# EasyEDA Pro project ProPrj_stm32智能手表_2026-07-06.epro

# Schematic Schematic1

## Sheets
1 P1: Assembly Variant: Basic; Board Name: Board1; Create Date: 2026-06-28; Page Name: P1; Project Name: stm32智能手表; Schematic Name: Schematic1; Update Date: 2026-06-28; Company: 嘉立创EDA; Page Size: A4; Version: V1.0
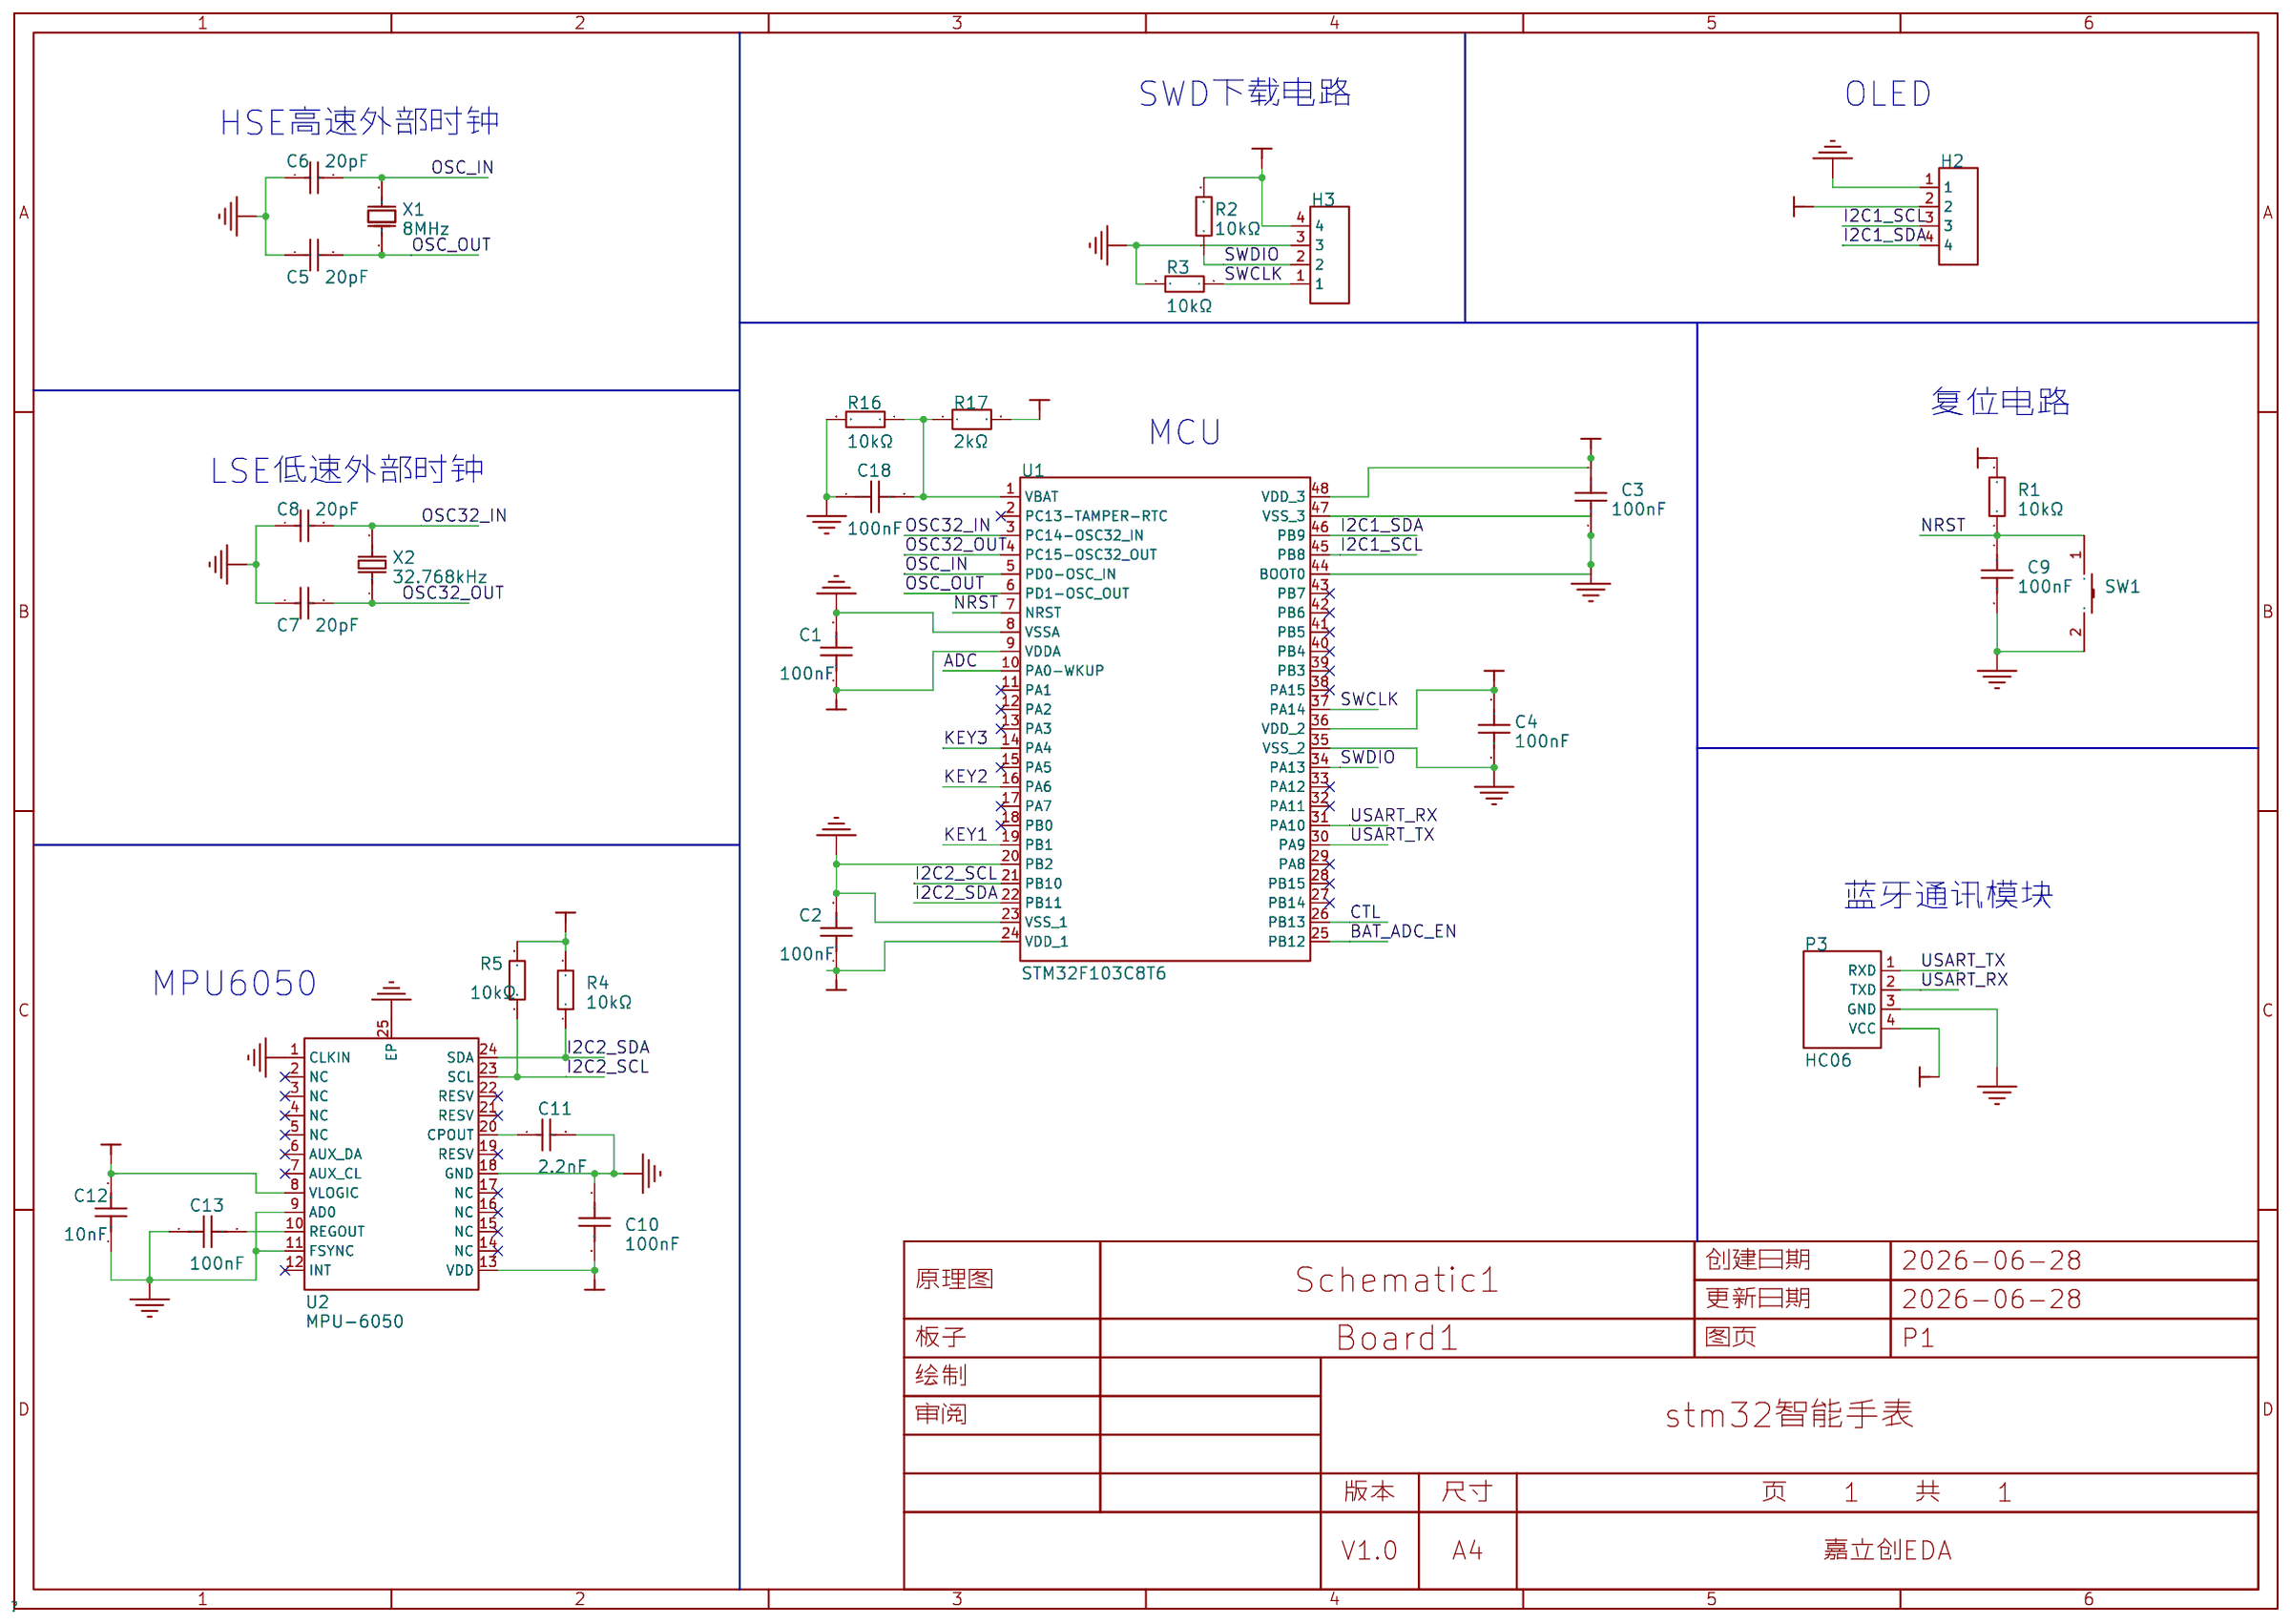
[diagram p0: P1]
2 P1_1: Schematic Name: Schematic2
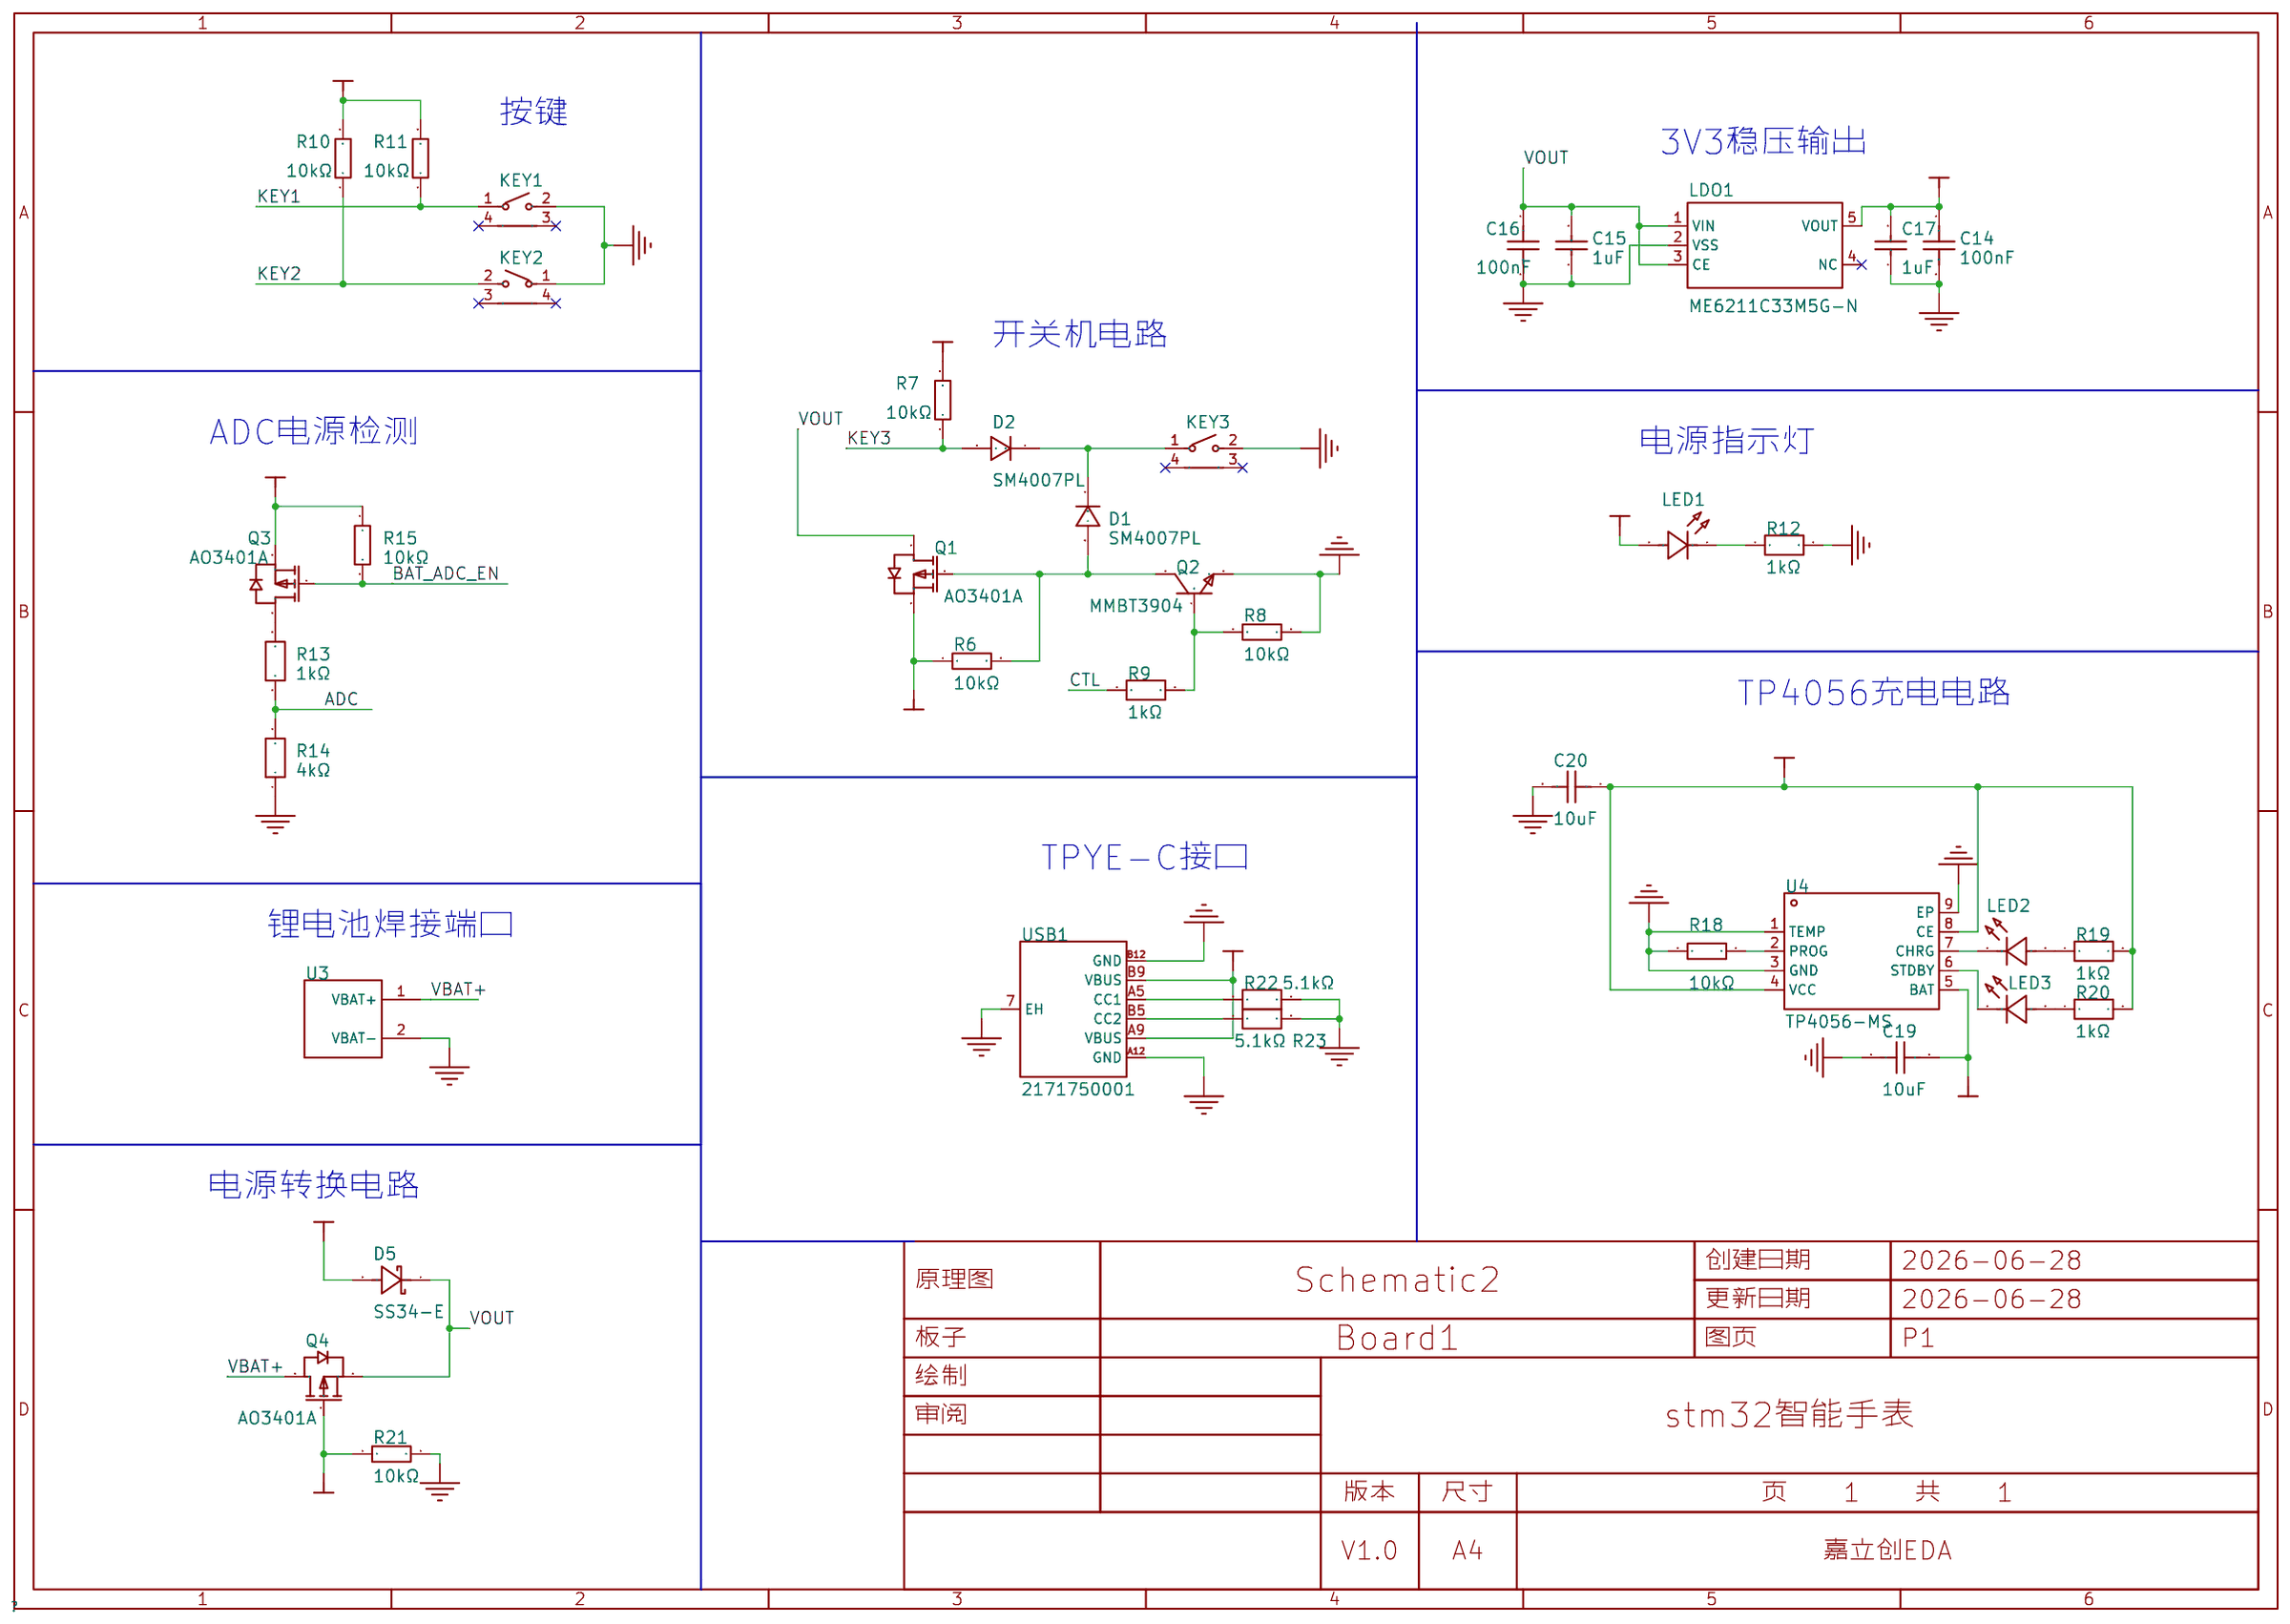
[diagram p1: P1_1]

## Parts
sheet P1
C1  100nF  [C0603]
C2  100nF  [C0603]
C3  100nF  [C0603]
C4  100nF  [C0603]
C5  20pF  [C0603]
C6  20pF  [C0603]
C7  20pF  [C0603]
C8  20pF  [C0603]
C9  100nF  [C0603]
C10  100nF  [C0603]
C11  2.2nF  [C0603]
C12  10nF  [C0603]
C13  100nF  [C0603]
C18  100nF  [C0603]
H2  HC-PM254-5.0H-1x4PZ-02A  [HDR-TH_4P-P2.54-V-F]
H3  PZ2.54R-1X4P-H25  [HDR-TH_4P-P2.54-H-M-W10.0]
P3  HC06  [HC06]
R1  10kΩ  [R0603]
R2  10kΩ  [R0603]
R3  10kΩ  [R0603]
R4  10kΩ  [R0603]
R5  10kΩ  [R0603]
R16  10kΩ  [R0603]
R17  2kΩ  [R0603]
SW1  TS-1101-C-W  [SW-SMD_L6.0-W3.3-LS8.0_TS-1101-C-W]
U1  STM32F103C8T6  [LQFP-48_L7.0-W7.0-P0.50-LS9.0-BL]
U2  MPU-6050  [QFN-24_L4.0-W4.0-P0.50-BL-EP2.7]
X1  8MHz  [CRYSTAL-SMD_L5.0-W3.2]
X2  32.768kHz  [FC-135R_L3.2-W1.5]
sheet P1_1
C14  100nF  [C0603]
C15  1uF  [C0603]
C16  100nF  [C0603]
C17  1uF  [C0603]
C19  10uF  [C0603]
C20  10uF  [C0603]
D1  SM4007PL  [SOD-123F_L2.8-W1.8-LS3.7-RD]
D2  SM4007PL  [SOD-123F_L2.8-W1.8-LS3.7-RD]
D5  SS34-E  [SMA_L4.2-W2.6-LS5.0-RD]
KEY1  GT-TC018A-H0375-L1  [SW-SMD_L4.7-W3.5-P3.35-EH]
KEY2  GT-TC018A-H0375-L1  [SW-SMD_L4.7-W3.5-P3.35-EH]
KEY3  GT-TC018A-H0375-L1  [SW-SMD_L4.7-W3.5-P3.35-EH]
LDO1  ME6211C33M5G-N  [SOT-23-5_L3.0-W1.7-P0.95-LS2.8-BL]
LED1  XL-1608SURC-06  [LED0603-RD_RED]
LED2  XL-1608SURC-06  [LED0603-RD_RED]
LED3  F.0603.00025/P2-0603G1TS2-06T-002  [LED0603-RD_GREEN]
Q1  AO3401A  [SOT-23_L2.9-W1.3-P1.90-LS2.4-BR]
Q2  MMBT3904  [SOT-23-3_L2.9-W1.3-P1.90-LS2.4-BR]
Q3  AO3401A  [SOT-23_L2.9-W1.3-P1.90-LS2.4-BR]
Q4  AO3401A  [SOT-23_L2.9-W1.3-P1.90-LS2.4-BR]
R6  10kΩ  [R0603]
R7  10kΩ  [R0603]
R8  10kΩ  [R0603]
R9  1kΩ  [R0603]
R10  10kΩ  [R0603]
R11  10kΩ  [R0603]
R12  1kΩ  [R0603]
R13  1kΩ  [R0603]
R14  4kΩ  [R0603]
R15  10kΩ  [R0603]
R18  10kΩ  [R0603]
R19  1kΩ  [R0603]
R20  1kΩ  [R0603]
R21  10kΩ  [R0603]
R22  5.1kΩ  [R0603]
R23  5.1kΩ  [R0603]
U3  -  [302530BAT]
U4  TP4056-MS  [SOP-8_L4.9-W3.9-P1.27-LS6.0-TL-EP]
USB1  2171750001  [TYPE-C-SMD_TYPE-C-6P_USB4125-GF-A-0190]

## Library data of the parts
C1-C4 C9 C10 C13 C14 C16 C18 = CC0603KRX7R9BB104: 容值:100nF;精度:±10%;额定电压:50V;温度系数:X7R;; LCSC Part Name: 100nF ±10% 50V; Supplier Part: C14663; Manufacturer: YAGEO(国巨); Supplier Footprint: 0603; JLCPCB Part Class: Basic Part; Datasheet: https://item.szlcsc.com/datasheet/CC0603KRX7R9BB104/15331.html; Supplier: LCSC; Tolerance: ±10%; Voltage Rating: 50V; Temperature Coefficient: X7R
C5-C8 = CL10C200JB8NNNC: 容值:20pF;精度:±5%;额定电压:50V;温度系数:C0G;; LCSC Part Name: 20pF ±5% 50V; Supplier Part: C1648; Manufacturer: SAMSUNG(三星); Supplier Footprint: 0603; JLCPCB Part Class: Basic Part; Datasheet: https://item.szlcsc.com/datasheet/CL10C200JB8NNNC/2000.html; Supplier: LCSC; Tolerance: ±5%; Voltage Rating: 50V; Temperature Coefficient: C0G
C11 = 0603B222K500NT: 容值:2.2nF;精度:±10%;额定电压:50V;温度系数:X7R;; LCSC Part Name: 2.2nF ±10% 50V; Supplier Part: C1604; Manufacturer: FH(风华); Supplier Footprint: 0603; JLCPCB Part Class: Basic Part; Datasheet: https://item.szlcsc.com/datasheet/0603B222K500NT/1956.html; Supplier: LCSC; Tolerance: ±10%; Voltage Rating: 50V; Temperature Coefficient: X7R
C12 = GRM1885C1H103JA01D: 容值:10nF;精度:±5%;额定电压:50V;材质(温度系数):C0G;; LCSC Part Name: 10nF ±5% 50V; Supplier Part: C85973; Manufacturer: muRata(村田); Supplier Footprint: 0603; JLCPCB Part Class: Extended Part; Datasheet: https://atta.szlcsc.com/upload/public/pdf/source/20200305/C490387_23319AE8C154DEB24C505E6C82A8106A.pdf; Supplier: LCSC; Tolerance: ±5%; Voltage Rated: 50V; Temperature Coefficient: C0G
H2 = HC-PM254-5.0H-1x4PZ-02A: 插孔结构:1x4P;间距:2.54mm;行距:-;圆孔/方孔:方孔;安装方式:直插;排数:单排;总孔位数:4P;额定电流:3A;额定电压:-;插孔方向:顶部;塑高:5mm;触头材质:黄铜;触头镀层:金;工作温度:-40℃~+105℃;; LCSC Part Name: 间距2.54mm 1x4Pin 直插 PC3.0 H5.0; Supplier Part: C42163122; Manufacturer: HC(虹成电子); Supplier Footprint: 插件,P=2.54mm; JLCPCB Part Class: Extended Part; Datasheet: https://item.szlcsc.com/datasheet/HC-PM254-5.0H-1x4PZ-02A/44033111.html; Supplier: LCSC; Holes Structure: 1x4P; Pitch: 2.54mm; Circular Hole / Square Hole: 方孔; Mounting Type: 直插; Number of Rows: 单排; Number of Positions: 4P; Current Rating: 3A; Holes Direction: 顶部; Insulation Height: 5mm; Contact Material: 黄铜; Contact Plating: 金; Operating Temperature: -40℃~+105℃; PIN Length: 3mm
H3 = PZ2.54R-1X4P-H25: 插针结构:1x4P;间距:2.54mm;行距:-;圆针/方针:方针;安装方式:弯插;排数:单排;总PIN位数:4P;额定电流:3A;额定电压:-;配合针长度:6mm;塑高:2.5mm;端接针长度:3mm;触头材质:黄铜;触头镀层:金;工作温度:-40℃~+105℃;颜色:黑色;; LCSC Part Name: 1x4P 间距:2.54mm 方针 弯插; Supplier Part: C42431821; Manufacturer: JXTCONN(聚兴泰); Supplier Footprint: 弯插,P=2.54mm; JLCPCB Part Class: Extended Part; Datasheet: https://item.szlcsc.com/datasheet/PZ2.54R-1X4P-H25/44458951.html; Supplier: LCSC; Pin Structure: 1x4P; Pitch: 2.54mm; Circluar Pins/Square Pins: 方针; Mounting Type: 弯插; Number of Rows: 单排; Number of Pins: 4P; Current Rating: 3A; Length of Mating Pin: 6mm; Insulation Height: 2.5mm; Length of End Connection Pin: 3mm; Contact Material: 黄铜; Contact Plating: 金; Operating Temperature: -40℃~+105℃; Color: 黑色
P3 = HC06: _: 3
R1-R8 R10 R11 R15 R16 R18 R21 = RT0603BRD0710KL: 电阻类型:薄膜电阻;阻值:10kΩ;精度:±0.1%;功率:100mW;工作电压:75V;温度系数:±25ppm/℃;; LCSC Part Name: 薄膜电阻 10kΩ ±0.1% 100mW; Supplier Part: C95204; Manufacturer: YAGEO(国巨); Supplier Footprint: 0603; JLCPCB Part Class: Extended Part; Datasheet: https://item.szlcsc.com/datasheet/RT0603BRD0710KL/96405.html; Supplier: LCSC; Type: 薄膜电阻; Tolerance: ±0.1%; Power(Watts): 100mW; Voltage-Supply(Max): 75V; Temperature Coefficient: ±25ppm/℃; Operating Temperature: -55℃~+155℃
R17 = FRC0603F2001TS: 电阻类型:厚膜电阻;阻值:2kΩ;精度:±1%;功率:100mW;工作电压:75V;温度系数:±100ppm/℃;; LCSC Part Name: 2kΩ ±1% 100mW 厚膜电阻; Supplier Part: C2907022; Manufacturer: FOJAN(富捷); Supplier Footprint: 0603; JLCPCB Part Class: Extended Part; Datasheet: https://item.szlcsc.com/datasheet/FRC0603F2001TS/3180535.html; Supplier: LCSC; Type: 厚膜电阻; Tolerance: ±1%; Power(Watts): 100mW; Voltage-Supply(Max): 75V; Temperature Coefficient: ±100ppm/℃; Operating Temperature: -55℃~+155℃
SW1 = TS-1101-C-W: 电路结构:单刀单掷;按钮形状:矩形按钮;作用力:2.6N;安装方式:立贴;开关长度:6mm;开关宽度:3.6mm;开关高度:2.5mm;带支架:不带支架;触点电流:50mA;额定电压:12V;带灯:无;工作寿命:5万次;; LCSC Part Name: 6*3.6*2.5mm 立贴 轻触开关; Supplier Part: C318938; Manufacturer: XKB Connection(中国星坤); Supplier Footprint: SMD,6x3.6mm; JLCPCB Part Class: Extended Part; Datasheet: https://item.szlcsc.com/datasheet/TS-1101-C-W/300030.html; Supplier: LCSC; Circuit: 单刀单掷; Actuator Style: 矩形按钮; Operating Force: 2.6N; Mounting Type: 立贴; Length: 6mm; Width: 3.6mm; Switch Height: 2.5mm; with Bracket: 不带支架; Contact Current: 50mA; Voltage Rating: 12V; With Lamp: 无; Life: 5万次; Operating Temperature: -30℃~+85℃
U1 = STM32F103C8T6: CPU内核:ARM-M3;CPU最大主频:72MHz;应用领域:-;; LCSC Part Name: 主流增强型ARM Cortex-M3 MCU，具有64 KB Flash、72 MHz CPU、电机控制、USB和CAN; Supplier Part: C8734; Manufacturer: ST(意法半导体); Supplier Footprint: LQFP-48(7x7); JLCPCB Part Class: Extended Part; Datasheet: https://item.szlcsc.com/datasheet/STM32F103C8T6/9243.html; Supplier: LCSC; CPU Core: ARM-M3; CPU Maximum Speed: 72MHz; Program Storage Size: 64KB; Program Memory Type: FLASH; Number of I/O: 37; ADC (Bit): 12bit; Voltage - Supply: 2V~3.6V
U2 = MPU-6050: 传感器类型:IMU(加速度计+陀螺仪);接口类型:I2C;; Supplier Part: C24112; Manufacturer: TDK InvenSense(应美盛); Supplier Footprint: QFN-24-EP(4x4); JLCPCB Part Class: Extended Part; Datasheet: https://item.szlcsc.com/datasheet/MPU-6050/24852.html; Supplier: LCSC; Accelerometer Sensing Axis: X,Y,Z; Acceleration Measurement Range (MAX): ±16g; Gyroscope Sensing Axis: X,Y,Z; Gyroscope Measurement Range (MAX): ±2000dps; Sensor Type: IMU(加速度计+陀螺仪); Output Bits: 16bit; Interface: I2C; Voltage - Supply: 2.375V~3.46V; Cache Size: 1KB; Standby Current: 5uA; Operating Temperature: -40℃~+85℃; Features: 运动事件检测；同步与时间戳
X1 = X50328MSB2GI: 晶振类型:贴片晶振;频率:8MHz;常温频差:±10ppm;负载电容:20pF;频率稳定度:±20ppm;; LCSC Part Name: YSX530GA 8MHZ 2P 5032 20PF ±10PPM -40~85℃ (±20PPM); Supplier Part: C115962; Manufacturer: YXC(扬兴晶振); Supplier Footprint: SMD5032-2P; JLCPCB Part Class: Basic Part; Datasheet: https://item.szlcsc.com/datasheet/X50328MSB2GI/117214.html; Supplier: LCSC; Type: 贴片晶振; Normal temperature Frequency Tolerance: ±10ppm; Load Capacitance: 20pF; Frequency Stability: ±20ppm; Operating Temperature: -40℃~+85℃
X2 = Q13FC13500004_C32346: 晶振类型:贴片晶振;频率:32.768kHz;常温频差:±20ppm;负载电容:12.5pF;; LCSC Part Name: 32.768kHz ±20ppm 12.5pF; Supplier Part: C32346; Manufacturer: EPSON(爱普生); Manufacturer Part: Q13FC13500004; Supplier Footprint: SMD3215-2P; JLCPCB Part Class: Basic Part; Datasheet: https://item.szlcsc.com/datasheet/Q13FC13500004/33310.html; Supplier: LCSC; Type: 贴片晶振; Normal temperature Frequency Tolerance: ±20ppm; Load Capacitance: 12.5pF; Equivalent Series Resistance(ESR): 70kΩ; Operating Temperature: -40℃~+85℃
C15 C17 = CL10A105KO8NNNC: 容值:1uF;精度:±10%;额定电压:16V;温度系数:X5R;; LCSC Part Name: 1uF ±10% 16V; Supplier Part: C1592; Manufacturer: SAMSUNG(三星); Supplier Footprint: 0603; JLCPCB Part Class: Extended Part; Datasheet: https://item.szlcsc.com/datasheet/CL10A105KO8NNNC/1944.html; Supplier: LCSC; Tolerance: ±10%; Voltage Rating: 16V; Temperature Coefficient: X5R
C19 C20 = CL10A106MQ8NNNC: 容值:10uF;精度:±20%;额定电压:6.3V;温度系数:X5R;; LCSC Part Name: 10uF ±20% 6.3V; Supplier Part: C1691; Manufacturer: SAMSUNG(三星); Supplier Footprint: 0603; JLCPCB Part Class: Extended Part; Datasheet: https://item.szlcsc.com/datasheet/CL10A106MQ8NNNC/2043.html; Supplier: LCSC; Tolerance: ±20%; Voltage Rating: 6.3V; Temperature Coefficient: X5R
D1 D2 = SM4007PL_C64898: 二极管配置:独立式;正向压降(Vf):1.1V@1A;直流反向耐压(Vr):1kV;整流电流:1A;; LCSC Part Name: 1kV 1A; Supplier Part: C64898; Manufacturer: MDD(辰达半导体); Supplier Footprint: SOD-123FL; JLCPCB Part Class: Basic Part; Datasheet: https://item.szlcsc.com/datasheet/SM4007PL/65968.html; Supplier: LCSC; Diode Configuration: 独立式; Voltage - Forward(Vf@If): 1.1V@1A; Voltage - DC Reverse(Vr): 1kV; Current - Rectified: 1A; Reverse Leakage Current (Ir): 10uA@1kV; Non-Repetitive Peak Forward Surge Current: 25A; Operating Junction Temperature Range: -55℃~+150℃
D5 = SS34-E: 正向压降(Vf):600mV@3A;直流反向耐压(Vr):40V;整流电流:3A;; LCSC Part Name: SMA封装肖特基二极管; Supplier Part: C45406501; Manufacturer: MDD(辰达半导体); Supplier Footprint: SMA; JLCPCB Part Class: Extended Part; Datasheet: https://item.szlcsc.com/datasheet/SS34-E/47507899.html; Supplier: LCSC; Voltage - Forward(Vf@If): 600mV@3A; Voltage - DC Reverse(Vr): 40V; Current - Rectified: 3A; Reverse Leakage Current (Ir): 500uA@40V; Operating Junction Temperature Range: -55℃~+125℃; Non-Repetitive Peak Forward Surge Current: 75A
KEY1-KEY3 = GT-TC018A-H0375-L1: 电路结构:单刀单掷;按钮形状:矩形按钮;作用力:1.6N;安装方式:卧贴;开关长度:4.7mm;开关宽度:1.9mm;开关高度:3.75mm;带支架:带支架;触点电流:50mA;额定电压:12V;带灯:无;工作寿命:10万次;; LCSC Part Name: 4.7*1.9*3.75mm 卧贴 轻触开关; Supplier Part: C963235; Manufacturer: G-Switch(品赞); Supplier Footprint: SMD,4.7x1.9mm; JLCPCB Part Class: Extended Part; Datasheet: https://item.szlcsc.com/datasheet/GT-TC018A-H0375-L1/1046870.html; Supplier: LCSC; Circuit: 单刀单掷; Actuator Style: 矩形按钮; Operating Force: 1.6N; Mounting Type: 卧贴; Length: 4.7mm; Width: 1.9mm; Switch Height: 3.75mm; with Bracket: 带支架; Contact Current: 50mA; Voltage Rating: 12V; Actuator/Cap Color: 黑色; With Lamp: 无; Termination Style: SMD接片; Life: 10万次; Operating Temperature: -30℃~+85℃
LDO1 = ME6211C33M5G-N: 输出极性:正极;工作电压:6V;输出电压:3.3V;输出电流:500mA;电源纹波抑制比(PSRR):70dB@(1kHz);输出类型:固定;; LCSC Part Name: 3.3V 500mA 6V; Supplier Part: C82942; Manufacturer: MICRONE(南京微盟); Supplier Footprint: SOT-23-5; JLCPCB Part Class: Extended Part; Datasheet: https://item.szlcsc.com/datasheet/ME6211C33M5G-N/84106.html; Supplier: LCSC; Output Configuration: 正极; Voltage - Supply: 6V; Output Voltage: 3.3V; Output Current: 500mA; Power Supply Rejection Ratio (PSRR): 70dB@(1kHz); Voltage Dropout: 120mV@(100mA); standby current: 60uA; Noise: 50uVrms; Features: 使能控制；短路保护；过流保护; Operating Temperature: -40℃~+150℃; Output Type: 固定; Number of Outputs: 1
LED1 LED2 = XL-1608SURC-06: 灯头类型:1.6mmx0.8mm方形灯头;发光颜色:红色;正向压降(Vf):2.3V;功率:50mW;正向电流:20mA;波长:620nm~630nm;二极管配置:独立二极管;透镜颜色:无色透明透镜;色温:-;发光强度:225mcd;发光角度:120°;载带方式:正贴;工作温度:-40℃~+85℃;; LCSC Part Name: 0603红色贴片式发光二极管; Supplier Part: C965799; Manufacturer: XINGLIGHT(成兴光); Supplier Footprint: 0603; JLCPCB Part Class: Extended Part; Datasheet: https://item.szlcsc.com/datasheet/XL-1608SURC-06/1051408.html; Supplier: LCSC; Lamp Holder Type: 1.6mmx0.8mm方形灯头; Illumination Color: 红色; Voltage - Forward(Vf): 2.3V; Power(Watts): 50mW; Forward Current: 20mA; Wavelength - Dominant: 620nm~630nm; Peak Wavelength: 625nm; Diode Configuration: 独立二极管; Lens Color: 无色透明透镜; Luminous Intensity: 225mcd; Viewing Angle: 120°; Mounting Style: 正贴; Operating Temperature: -40℃~+85℃
LED3 = F.0603.00025/P2-0603G1TS2-06T-002: 灯头类型:1.6mmx0.8mm方形灯头;发光颜色:翠绿色;正向压降(Vf):2.6V~2.9V;功率:90mW;正向电流:30mA;波长:520nm~525nm;二极管配置:独立二极管;透镜颜色:-;色温:-;发光强度:230mcd;发光角度:120°;载带方式:-;工作温度:-40℃~+85℃;; LCSC Part Name: 0603翠绿; Supplier Part: C7496818; Manufacturer: TUOZHAN(拓展光电); Supplier Footprint: 0603; JLCPCB Part Class: Extended Part; Datasheet: https://item.szlcsc.com/datasheet/F.0603.00025%252FP2-0603G1TS2-06T-002/8563182.html; Supplier: LCSC; Lamp Holder Type: 1.6mmx0.8mm方形灯头; Illumination Color: 翠绿色; Voltage - Forward(Vf): 2.6V~2.9V; Power(Watts): 90mW; Forward Current: 30mA; Wavelength - Dominant: 520nm~525nm; Peak Wavelength: 517nm; Diode Configuration: 独立二极管; Luminous Intensity: 230mcd; Viewing Angle: 120°; Operating Temperature: -40℃~+85℃
Q1 Q3 Q4 = AO3401A_C347476: 数量:1个P沟道;漏源电压(Vdss):30V;连续漏极电流(Id):4.2A;导通电阻(RDS(on)):50mΩ@10V;耗散功率(Pd):1.4W;阈值电压(Vgs(th)):1.3V@250uA;; LCSC Part Name: 1个P沟道 耐压:30V 电流:4.2A; Supplier Part: C347476; Manufacturer: UMW(友台半导体); Supplier Footprint: SOT-23; JLCPCB Part Class: Extended Part; Datasheet: https://item.szlcsc.com/datasheet/AO3401A/324136.html; Supplier: LCSC; Number: 1个P沟道; Drain to Source Voltage: 30V; Current - Continuous Drain(Id): 4.2A; RDS(on): 50mΩ@10V; Pd - Power Dissipation: 1.4W; Gate Threshold Voltage (Vgs(th)): 1.3V@250uA; Gate Charge(Qg): 9.4nC@4.5V; Input Capacitance(Ciss): 954pF; Reverse Transfer Capacitance (Crss@Vds): 77pF; Operating Temperature: -55℃~+150℃; Type: P沟道; Output Capacitance(Coss): 115pF
Q2 = MMBT3904_C7420353: 晶体管类型:NPN;集电极电流(Ic):200mA;集射极击穿电压(Vceo):40V;耗散功率(Pd):200mW;直流电流增益(hFE):100@10mA,1.0V;; LCSC Part Name: hFE:100-300，丝印:1AM NPN 电流:200mA 电压:40V; Supplier Part: C7420353; Manufacturer: R+O(宏嘉诚); Supplier Footprint: SOT-23; JLCPCB Part Class: Extended Part; Datasheet: https://item.szlcsc.com/datasheet/MMBT3904/8397175.html; Supplier: LCSC; type: NPN; Current - Collector(Ic): 200mA; Collector - Emitter Voltage VCEO: 40V; Pd - Power Dissipation: 200mW; DC Current Gain: 100@10mA,1.0V; Transition frequency(fT): 300MHz; Current - Collector Cutoff: 100nA; Vce Saturation(VCE(sat)): 300mV; Operating Temperature: -55℃~+150℃; Emitter-Base Voltage(Vebo): 6V
R9 R12 R13 R19 R20 = FRC0603F1001TS: 电阻类型:厚膜电阻;阻值:1kΩ;精度:±1%;功率:100mW;工作电压:75V;温度系数:±100ppm/℃;; LCSC Part Name: 1kΩ ±1% 100mW 厚膜电阻; Supplier Part: C2907002; Manufacturer: FOJAN(富捷); Supplier Footprint: 0603; JLCPCB Part Class: Extended Part; Supplier: LCSC; Type: 厚膜电阻; Tolerance: ±1%; Power(Watts): 100mW; Voltage-Supply(Max): 75V; Temperature Coefficient: ±100ppm/℃; Operating Temperature: -55℃~+155℃
R14 = ARG03FTC4001N: 电阻类型:薄膜电阻;阻值:4kΩ;精度:±1%;功率:100mW;工作电压:75V;温度系数:±25ppm/℃;; LCSC Part Name: 薄膜电阻 4kΩ ±1% 100mW; Supplier Part: C2984443; Manufacturer: Viking(光颉); Supplier Footprint: 0603; JLCPCB Part Class: Extended Part; Datasheet: https://item.szlcsc.com/datasheet/ARG03FTC4001N/3425978.html; Supplier: LCSC; Type: 薄膜电阻; Tolerance: ±1%; Power(Watts): 100mW; Voltage-Supply(Max): 75V; Temperature Coefficient: ±25ppm/℃; Operating Temperature: -55℃~+155℃
R22 R23 = FRC0603F5101TS: 电阻类型:厚膜电阻;阻值:5.1kΩ;精度:±1%;功率:100mW;工作电压:75V;温度系数:±100ppm/℃;; LCSC Part Name: 5.1kΩ ±1% 100mW 厚膜电阻; Supplier Part: C2907044; Manufacturer: FOJAN(富捷); Supplier Footprint: 0603; JLCPCB Part Class: Extended Part; Supplier: LCSC; Type: 厚膜电阻; Tolerance: ±1%; Power(Watts): 100mW; Voltage-Supply(Max): 75V; Temperature Coefficient: ±100ppm/℃; Operating Temperature: -55℃~+155℃
U3 = 302530BAT
U4 = TP4056-MS: 工作电压:4.2V~9V;最大充电电流:1A;电池类型:锂电池;电池节数:1;; LCSC Part Name: 单节锂离子电池充电器; Supplier Part: C7473158; Manufacturer: MSKSEMI(美森科); Supplier Footprint: SOP-8-EP; JLCPCB Part Class: Extended Part; Datasheet: https://item.szlcsc.com/datasheet/TP4056-MS/8533532.html; Supplier: LCSC; The Chip Type: 充电芯片; Voltage - Supply: 4.2V~9V; Charge Current - Max: 1A; Charging Saturation Voltage: 4.2V; Type of Battery: 锂电池; Number of Cells: 1; Operating Temperature: -40℃~+85℃; Battery Temperature Detection: 支持; Supply Current (Iq): 70uA; Features: 恒压充电；恒流充电；自动再充电；充电终止；软启动；可编程充电电流；欠压锁定；涓流充电
USB1 = 2171750001: 连接器类型:Type-C;协议标准:USB 2.0;公母:母;触点数量:6P;端口数量:1;额定电流 - 电源:3A;工作温度:-40℃~+85℃;; LCSC Part Name: Type-C 母; Supplier Part: C3197922; Manufacturer: MOLEX; Supplier Footprint: SMD; JLCPCB Part Class: Extended Part; Datasheet: https://www.molex.com/content/dam/molex/molex-dot-com/products/automated/en-us/salesdrawingpdf/217/217175/2171750001_sd.pdf?inline\; Supplier: LCSC; Connector Type: Type-C; Protocol Standard: USB 2.0; Gender: 母; Number of Contacts: 6P; Number of Ports: 1; Current Rating-Power: 3A; Voltage Rating: 30V; Connect-Disconnect Life: 1万次; Detection color: 黑色; Operating Temperature: -40℃~+85℃

## Nets
3V3: C1.1 C2.1 C3.1 C4.1 C10.2 C12.2 C14.1 C17.2 H2.2 H3.4 LDO1.5(VOUT) LED1.2(A) P3.4(VCC) R1.2 R2.2 R4.2 R5.2 R7.2 R10.2 R11.2 U1.9(VDDA) U1.24(VDD_1) U1.36(VDD_2) U1.48(VDD_3) U2.8(VLOGIC) U2.13(VDD)
+5V: C20.1 D5.2(+) Q4.1(G) R19.2 R20.2 R21.1 U4.4(VCC) U4.8(CE) USB1.A9(VBUS) USB1.B9(VBUS)
GND: C1.2 C2.2 C3.2 C4.2 C5.1 C6.1 C7.1 C8.1 C9.2 C10.1 C11.2 C12.1 C13.1 C14.2 C15.1 C16.2 C17.1 C18.1 C19.2 C20.2 H2.1 H3.3 KEY1.2 KEY2.1 KEY3.2 LDO1.2(VSS) P3.3(GND) Q2.2(E) R3.2 R8.1 R12.2 R14.1 R16.2 R18.2 R21.2 R22.2 R23.2 SW1.2 U1.8(VSSA) U1.20(PB2) U1.23(VSS_1) U1.35(VSS_2) U1.44(BOOT0) U1.47(VSS_3) U2.1(CLKIN) U2.9(AD0) U2.11(FSYNC) U2.18(GND) U2.25(EP) U3.2(VBAT-) U4.1(TEMP) U4.3(GND) U4.9(EP) USB1.7(EH) USB1.A12(GND) USB1.B12(GND)
VBAT+: C19.1 Q1.2(S) Q3.2(S) Q4.3(D) R6.1 R15.1 R17.2 U3.1(VBAT+) U4.5(BAT)
ADC: R13.1 R14.2 U1.10(PA0-WKUP)
BAT_ADC_EN: Q3.1(G) R15.2 U1.25(PB12)
CTL: R9.1 U1.26(PB13)
I2C1_SCL: H2.3 U1.45(PB8)
I2C1_SDA: H2.4 U1.46(PB9)
I2C2_SCL: R5.1 U1.21(PB10) U2.23(SCL)
I2C2_SDA: R4.1 U1.22(PB11) U2.24(SDA)
KEY1: KEY1.1 R11.1 U1.19(PB1)
KEY2: KEY2.2 R10.1 U1.16(PA6)
KEY3: D2.2(A) R7.1 U1.14(PA4)
NRST: C9.1 R1.1 SW1.1 U1.7(NRST)
OSC32_IN: C8.2 U1.3(PC14-OSC32_IN) X2.2
OSC32_OUT: C7.2 U1.4(PC15-OSC32_OUT) X2.1
OSC_IN: C6.2 U1.5(PD0-OSC_IN) X1.2(OSC2)
OSC_OUT: C5.2 U1.6(PD1-OSC_OUT) X1.1(OSC1)
SWCLK: H3.1 R3.1 U1.37(PA14)
SWDIO: H3.2 R2.1 U1.34(PA13)
USART_RX: P3.2(TXD) U1.31(PA10)
USART_TX: P3.1(RXD) U1.30(PA9)
VOUT: C15.2 C16.1 D5.1(-) LDO1.1(VIN) LDO1.3(CE) Q1.3(D) Q4.2(S)
$1N72: C11.1 U2.20(CPOUT)
$1N125: C18.2 R16.1 R17.1 U1.1(VBAT)
$1N152: C13.2 U2.10(REGOUT)
$2N2: LED1.1(K) R12.1
$2N7: Q3.3(D) R13.2
$2N14: Q2.1(B) R8.2 R9.2
$2N19: D1.2(A) Q1.1(G) Q2.3(C) R6.2
$2N21: D1.1(C) D2.1(C) KEY3.1
$2N32: R22.1 USB1.A5(CC1)
$2N33: R23.1 USB1.B5(CC2)
$2N35: R18.1 U4.2(PROG)
$2N37: LED2.1(K) U4.7(CHRG)
$2N38: LED2.2(A) R19.1
$2N40: LED3.2(A) R20.1
$2N41: LED3.1(C) U4.6(STDBY)

Not connected (* = marked no-connect by the designer): KEY1 3* 4*; KEY2 3* 4*; KEY3 3* 4*; LDO1 4(NC)*; U1 2(PC13-TAMPER-RTC)* 11(PA1)* 12(PA2)* 13(PA3)* 15(PA5)* 17(PA7)* 18(PB0)* 27(PB14)* 28(PB15)* 29(PA8)* 32(PA11)* 33(PA12)* 38(PA15)* 39(PB3)* 40(PB4)* 41(PB5)* 42(PB6)* 43(PB7)*; U2 2(NC)* 3(NC)* 4(NC)* 5(NC)* 6(AUX_DA)* 7(AUX_CL)* 12(INT)* 14(NC)* 15(NC)* 16(NC)* 17(NC)* 19(RESV)* 21(RESV)* 22(RESV)*

## Notes on the sheets
sheet 1
- SWD下载电路
- OLED
- HSE高速外部时钟
- 复位电路
- MCU
- LSE低速外部时钟
- 蓝牙通讯模块
- MPU6050
sheet 2
- 按键
- 3V3稳压输出
- 开关机电路
- ADC电源检测
- 电源指示灯
- TP4056充电电路
- TPYE-C接口
- 锂电池焊接端口
- 电源转换电路

# Board PCB1
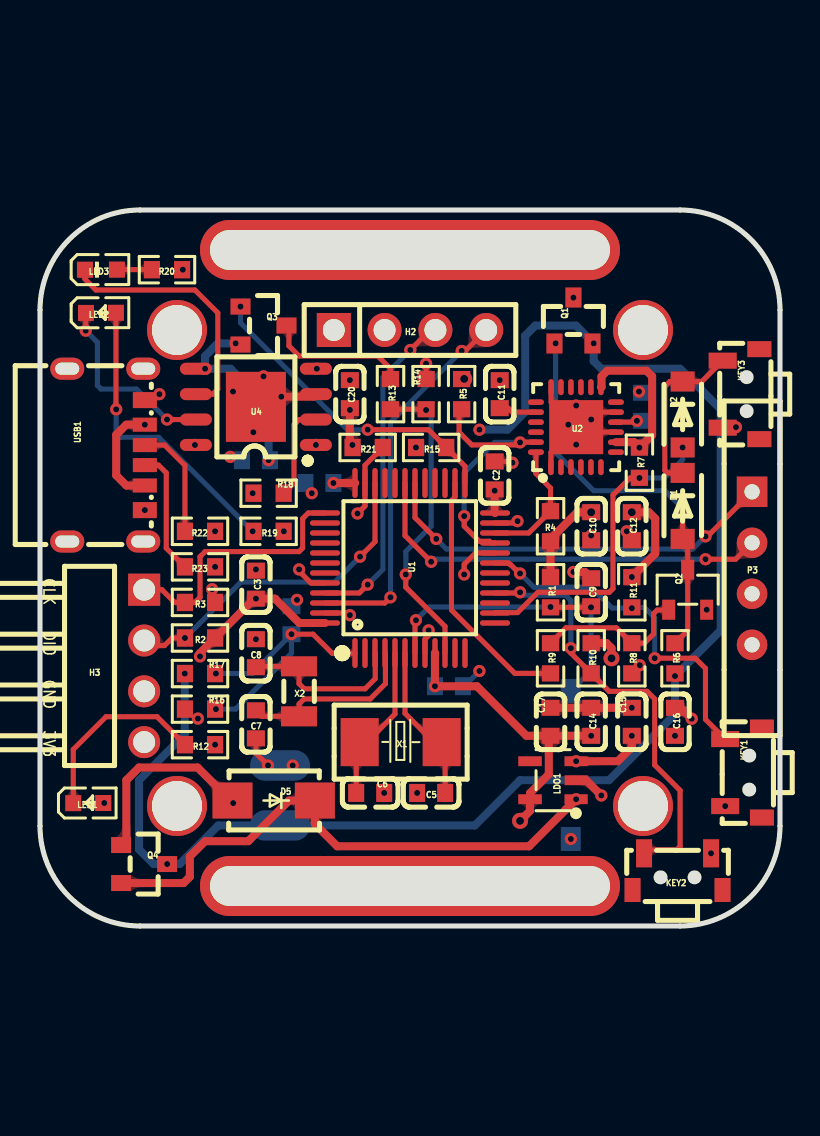
[diagram p2: board, top side]
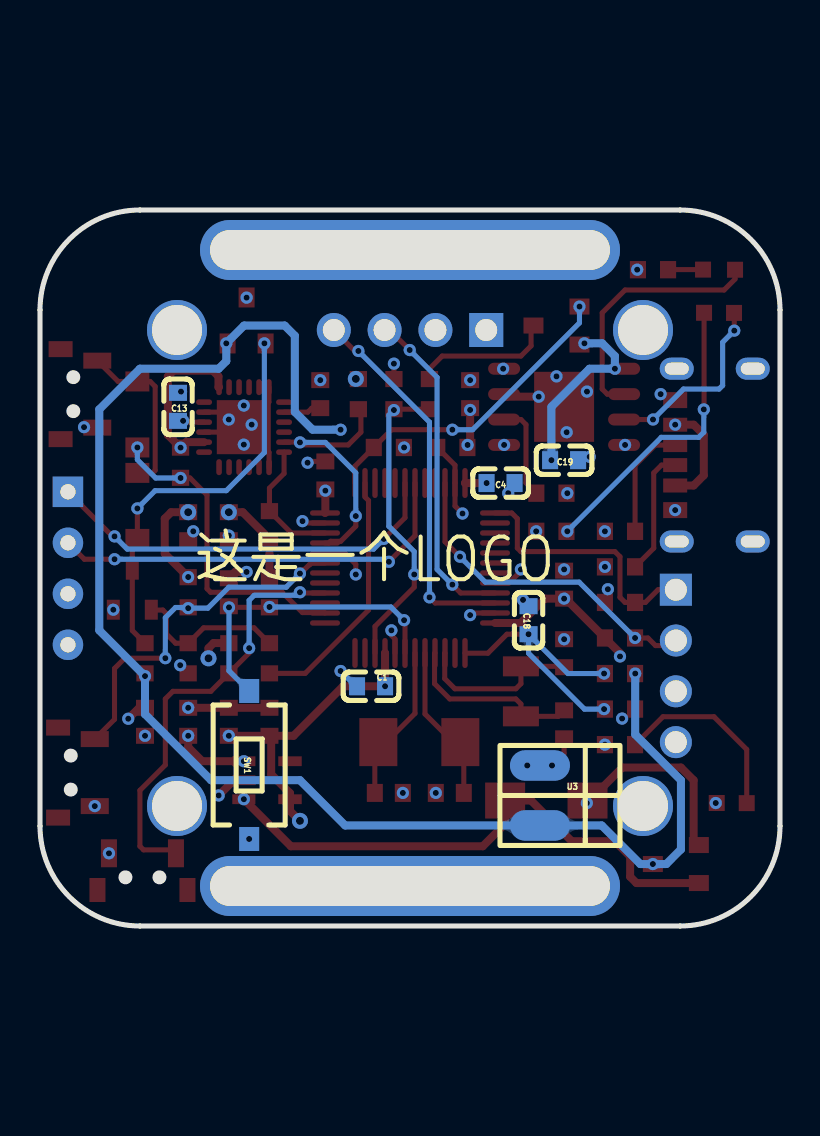
[diagram p3: board, bottom side, seen from below]

Outline 37 x 35.8 mm; copper layers: Top Layer, GND, PWR, Bottom Layer. Coordinates in mm from the lower left corner of the outline.
Outline path: 0,30.8 0,5 arc(1.46,1.46) 5,0 32,0 arc(35.54,1.46) 37,5 37,30.8 arc(35.54,34.34) 32,35.8 5,35.8 arc(1.46,34.34) 0,30.8
Stack: Top Layer 0.035mm Outer layer thickness 1oz / Dielectric1 0.2104mm 7628 RC49% 8.6mil / GND 0.0152mm Inner layer thickness / Dielectric2 1.065mm 1.1mm H/HOZ Copper / PWR 0.0152mm Inner layer thickness / Dielectric3 0.2104mm 7628 RC49% 8.6mil / Bottom Layer 0.035mm Outer layer thickness 1oz

## Design rules (mm)
spacing copperThickness1oz (default): track to track 0.102, other pairs 0.152 to 0.3
spacing copperThickness2oz: track to track 0.203, other pairs 0.152 to 0.3
track width copperThickness1oz (default): min 0.127, default 0.254, max 2.54
track width copperThickness2oz: min 0.203, default 0.254, max 2.54
differential pair differentialPair (default): width min 0.127, default 0.254, max 2.54; gap min 0.152, default 0.152

## Placement (name value [footprint] x y rotation side)
C1  100nF  [C0603]  20.45 11.99 0 bottom
C2  100nF  [C0603]  22.73 22.53 90 top
C3  100nF  [C0603]  10.79 17.07 90 top
C4  100nF  [C0603]  13.97 22.15 180 bottom
C5  20pF  [C0603]  19.56 6.65 0 top
C6  20pF  [C0603]  16.51 6.65 180 top
C7  20pF  [C0603]  10.79 10.08 90 top
C8  20pF  [C0603]  10.79 13.64 270 top
C9  100nF  [C0603]  27.56 16.69 90 top
C10  100nF  [C0603]  27.56 19.99 90 top
C11  2.2nF  [C0603]  22.99 26.59 90 top
C12  10nF  [C0603]  29.59 19.99 90 top
C13  100nF  [C0603]  30.1 25.96 270 bottom
C14  100nF  [C0603]  27.56 10.21 90 top
C15  1uF  [C0603]  29.59 10.21 270 top
C16  100nF  [C0603]  31.75 10.21 90 top
C17  1uF  [C0603]  25.53 10.21 270 top
C18  100nF  [C0603]  12.57 15.29 270 bottom
C19  10uF  [C0603]  10.79 23.29 180 bottom
C20  10uF  [C0603]  15.49 26.59 90 top
D1  SM4007PL  [SOD-123F_L2.8-W1.8-LS3.7-RD]  32.13 21 270 top
D2  SM4007PL  [SOD-123F_L2.8-W1.8-LS3.7-RD]  32.13 25.58 270 top
D5  SS34-E  [SMA_L4.2-W2.6-LS5.0-RD]  11.68 6.27 180 top
H2  HC-PM254-5.0H-1x4PZ-02A  [HDR-TH_4P-P2.54-V-F]  18.5 29.8 0 top
H3  PZ2.54R-1X4P-H25  [HDR-TH_4P-P2.54-H-M-W10.0]  5.21 13 270 top
KEY1  GT-TC018A-H0375-L1  [SW-SMD_L4.7-W3.5-P3.35-EH]  35.18 7.67 270 top
KEY2  GT-TC018A-H0375-L1  [SW-SMD_L4.7-W3.5-P3.35-EH]  31.88 2.72 180 top
KEY3  GT-TC018A-H0375-L1  [SW-SMD_L4.7-W3.5-P3.35-EH]  35.05 26.59 270 top
LDO1  ME6211C33M5G-N  [SOT-23-5_L3.0-W1.7-P0.95-LS2.8-BL]  25.65 7.29 90 top
LED1  XL-1608SURC-06  [LED0603-RD_RED]  2.41 6.15 0 top
LED2  XL-1608SURC-06  [LED0603-RD_RED]  3.05 30.66 0 top
LED3  F.0603.00025/P2-0603G1TS2-06T-002  [LED0603-RD_GREEN]  3.05 32.82 0 top
NOREF  -  [Pad_e32]  6.85 6 0 top
NOREF#2  -  [Pad_e35]  18.5 2 0 top
NOREF#3  -  [Pad_e33]  30.15 6 0 top
NOREF#4  -  [Pad_e34]  18.5 33.8 0 top
NOREF#5  -  [Pad_e31]  6.85 29.8 0 top
NOREF#6  -  [Pad_e30]  30.15 29.8 0 top
P3  -  [HC06]  35.6 21.71 0 top
Q1  AO3401A  [SOT-23_L2.9-W1.3-P1.90-LS2.4-BR]  26.67 30.28 270 top
Q2  MMBT3904  [SOT-23-3_L2.9-W1.3-P1.90-LS2.4-BR]  32.38 16.81 270 top
Q3  AO3401A  [SOT-23_L2.9-W1.3-P1.90-LS2.4-BR]  11.18 30.02 180 top
Q4  AO3401A  [SOT-23_L2.9-W1.3-P1.90-LS2.4-BR]  5.21 3.1 180 top
R1  10kΩ  [R0603]  25.53 16.69 90 top
R2  10kΩ  [R0603]  8 14.4 0 top
R3  10kΩ  [R0603]  8 16.18 0 top
R4  10kΩ  [R0603]  25.53 19.99 270 top
R5  10kΩ  [R0603]  21.08 26.59 90 top
R6  10kΩ  [R0603]  31.75 13.38 90 top
R7  10kΩ  [R0603]  29.97 23.16 90 top
R8  10kΩ  [R0603]  29.59 13.38 90 top
R9  1kΩ  [R0603]  25.53 13.38 90 top
R10  10kΩ  [R0603]  27.56 13.38 90 top
R11  10kΩ  [R0603]  29.59 16.69 90 top
R12  1kΩ  [R0603]  8 9.07 0 top
R13  1kΩ  [R0603]  17.53 26.59 90 top
R14  4kΩ  [R0603]  19.3 26.59 270 top
R15  10kΩ  [R0603]  19.56 23.93 0 top
R16  10kΩ  [R0603]  8 10.84 180 top
R17  2kΩ  [R0603]  8 12.62 180 top
R18  10kΩ  [R0603]  11.43 21.64 180 top
R19  1kΩ  [R0603]  11.43 19.73 0 top
R20  1kΩ  [R0603]  6.35 32.82 0 top
R21  10kΩ  [R0603]  16.38 23.93 0 top
R22  5.1kΩ  [R0603]  8 19.73 0 top
R23  5.1kΩ  [R0603]  8 17.96 0 top
SW1  TS-1101-C-W  [SW-SMD_L6.0-W3.3-LS8.0_TS-1101-C-W]  26.54 8.05 270 bottom
U1  STM32F103C8T6  [LQFP-48_L7.0-W7.0-P0.50-LS9.0-BL]  18.5 17.9 0 top
U2  MPU-6050  [QFN-24_L4.0-W4.0-P0.50-BL-EP2.7]  26.8 24.94 0 top
U3  -  [302530BAT]  8 6.53 0 bottom
U4  TP4056-MS  [SOP-8_L4.9-W3.9-P1.27-LS6.0-TL-EP]  10.79 25.96 180 top
USB1  2171750001  [TYPE-C-SMD_TYPE-C-6P_USB4125-GF-A-0190]  3.3 23.55 270 top
X1  8MHz  [CRYSTAL-SMD_L5.0-W3.2]  18.03 9.19 180 top
X2  32.768kHz  [FC-135R_L3.2-W1.5]  12.95 11.73 90 top

## Footprints (pads in the part's own frame, mm; a bottom-side part is the same pattern mirrored in y, then rotated)
302530BAT
  oval 3x1.524 smd: 1(4,1.5) 2(4,-1.5)
C0603
  rect 0.8x0.9 smd: 1(-0.7,0) 2(0.7,0)
CRYSTAL-SMD_L5.0-W3.2
  rect 1.9x2.4 smd: 1(-2.05,0) 2(2.05,0)
FC-135R_L3.2-W1.5
  rect 1x1.8 smd: 1(-1.25,0) 2(1.25,0)
HC06
  rect 1.524x1.524 hole 0.762: 1(0,0)
  round 1.524 hole 0.762: 2(0,-2.55) 3(0,-5.1) 4(0,-7.65)
HDR-TH_4P-P2.54-H-M-W10.0
  rect 1.6x1.6 hole 1.1: 1(-3.81,0)
  round 1.6 hole 1.1: 2(-1.27,0) 3(1.27,0) 4(3.81,0)
HDR-TH_4P-P2.54-V-F
  rect 1.7x1.7 hole 1.1: 1(-3.81,0)
  round 1.7 hole 1.1: 2(-1.27,0) 3(1.27,0) 4(3.81,0)
LED0603-RD_GREEN
  rect 0.8x0.8 smd: 1(-0.799,-0.004) 2(0.799,0.004)
LED0603-RD_RED
  rect 0.8x0.8 smd: 1(-0.749,-0.004) 2(0.749,0.004)
LQFP-48_L7.0-W7.0-P0.50-LS9.0-BL
  oval 0.27x1.5 smd: 1(-2.75,-4.25) 2(-2.25,-4.25) 3(-1.75,-4.25) 4(-1.25,-4.25) 5(-0.75,-4.25) 6(-0.25,-4.25) 7(0.25,-4.25) 8(0.75,-4.25) 9(1.25,-4.25) 10(1.75,-4.25) 11(2.25,-4.25) 12(2.75,-4.25) 25(2.75,4.25) 26(2.25,4.25) 27(1.75,4.25) 28(1.25,4.25) 29(0.75,4.25) 30(0.25,4.25) 31(-0.25,4.25) 32(-0.75,4.25) 33(-1.25,4.25) 34(-1.75,4.25) 35(-2.25,4.25) 36(-2.75,4.25)
  oval 1.5x0.27 smd: 13(4.25,-2.75) 14(4.25,-2.25) 15(4.25,-1.75) 16(4.25,-1.25) 17(4.25,-0.75) 18(4.25,-0.25) 19(4.25,0.25) 20(4.25,0.75) 21(4.25,1.25) 22(4.25,1.75) 23(4.25,2.25) 24(4.25,2.75) 37(-4.25,2.75) 38(-4.25,2.25) 39(-4.25,1.75) 40(-4.25,1.25) 41(-4.25,0.75) 42(-4.25,0.25) 43(-4.25,-0.25) 44(-4.25,-0.75) 45(-4.25,-1.25) 46(-4.25,-1.75) 47(-4.25,-2.25) 48(-4.25,-2.75)
Pad_e30
  round 3 hole 2.5: 1(0,0)
Pad_e31
  round 3 hole 2.5: 1(0,0)
Pad_e32
  round 3 hole 2.5: 1(0,0)
Pad_e33
  round 3 hole 2.5: 1(0,0)
Pad_e34
  oval 21x3 hole 20x2: 1(0,0)
Pad_e35
  oval 21x3 hole 20x2: 1(0,0)
QFN-24_L4.0-W4.0-P0.50-BL-EP2.7
  oval 0.28x0.8 smd: 1(-1.25,-2) 2(-0.75,-2) 3(-0.25,-2) 4(0.25,-2) 5(0.75,-2) 6(1.25,-2) 13(1.25,2) 14(0.75,2) 15(0.25,2) 16(-0.25,2) 17(-0.75,2) 18(-1.242,2)
  oval 0.8x0.28 smd: 7(2,-1.25) 8(2,-0.75) 9(2,-0.25) 10(2,0.25) 11(2,0.75) 12(2,1.25) 19(-2,1.25) 20(-2,0.75) 21(-2,0.25) 22(-2,-0.25) 23(-2,-0.75) 24(-2,-1.25)
  rect 2.7x2.7 smd: 25(0.013,0)
R0603
  rect 0.806x0.864 smd: 1(-0.753,0) 2(0.753,0)
SMA_L4.2-W2.6-LS5.0-RD
  rect 2x1.8 smd: 1(-2.06,0) 2(2.06,0)
SOD-123F_L2.8-W1.8-LS3.7-RD
  rect 1x1.2 smd: 1(-1.65,0) 2(1.65,0)
SOP-8_L4.9-W3.9-P1.27-LS6.0-TL-EP
  oval 1.6x0.6 smd: 1(-3,1.905) 2(-3,0.635) 3(-3,-0.635) 4(-3,-1.905) 5(3,-1.905) 6(3,-0.635) 7(3,0.635) 8(3,1.905)
  rect 3x3.5 smd: 9(0,0)
SOT-23-3_L2.9-W1.3-P1.90-LS2.4-BR
  rect 1x0.65 smd: 1(1,-0.95) 2(1,0.95) 3(-1,0)
SOT-23-5_L3.0-W1.7-P0.95-LS2.8-BL
  rect 0.49x1.157 smd: 1(-0.95,-1.153) 2(0,-1.153) 3(0.95,-1.153)
  rect 0.49x1.175 smd: 4(0.95,1.153) 5(-0.95,1.153)
SOT-23_L2.9-W1.3-P1.90-LS2.4-BR
  rect 1x0.8 smd: 1(1.15,-0.95) 2(1.15,0.95) 3(-1.15,0)
SW-SMD_L4.7-W3.5-P3.35-EH
  rect 0.8x1.4 smd: 1(-1.675,-0.917) 2(1.675,-0.917)
  rect 0.8x1.2 smd: 3(-2.25,0.917) 4(2.25,0.917)
SW-SMD_L6.0-W3.3-LS8.0_TS-1101-C-W
  rect 1.2x1 smd: 1(-3.7,0) 2(3.7,0)
TYPE-C-SMD_TYPE-C-6P_USB4125-GF-A-0190
  oval 1.1x1.7 hole 0.6x1.2: 7(-4.32,1.86) 7(-4.32,-1.94) 7(4.32,1.86) 7(4.32,-1.94)
  rect 0.7x1.2 smd: A5(-0.5,1.94) A9(1.52,1.94) B5(0.5,1.94) B9(-1.52,1.94)
  rect 0.8x1.2 smd: A12(2.75,1.94) B12(-2.75,1.94)

## Nets
As in the schematic.

Pads without a net: KEY1 3 4; KEY2 3 4; KEY3 3 4; LDO1 4; NOREF 1; NOREF#2 1; NOREF#3 1; NOREF#4 1; NOREF#5 1; NOREF#6 1; U1 2 11 12 13 15 17 18 27 28 29 32 33 38 39 40 41 42 43; U2 2 3 4 5 6 7 12 14 15 16 17 19 21 22

## Via types
v1: diameter 0.61, hole 0.305, Top Layer to Bottom Layer, 117 vias
v2: diameter 0.8, hole 0.4, Top Layer to Bottom Layer, 5 vias

## Routing (per net, layer and track width the routed paths; a pad name or vN(x,y) marks a point on that pad's centre or on a via; arc(x,y) is an arc through that point)
3V3: length 132.4
  Top Layer w0.4: U1.48 12.97,15.15 11.75,16.37 v1(10.79,16.37) 10.72,16.37 R2.2 8,13.65 v1(8,13.48) ; v2(28.57,13.38) 28.57,13.89 28.32,14.15 27.57,14.15 R10.2 ; v1(29.59,17.45) 30.76,18.62 30.76,20.37 30.44,20.69 v2(29.59,20.69) ; C17.2 24.32,9.51 21.84,11.99 v1(19.75,11.99) 19.75,13.65 U1.9 ; C17.2 25.44,9.42 25.44,7.58 24.5,6.64 LDO1.5 24.5,5.75 v2(24,5.26) ; C17.2 v1(27.56,9.51) ; U1.36 15.75,22.15 v1(14.67,22.15) ; U2.13 28.08,26.94 28.08,27.48 28.36,27.77 30.32,27.77 30.61,27.48 30.61,24.55 v1(29.97,23.92) 29.7,24.19 U2.8 ; R1.2 R4.2 25.53,19.35 26.86,20.69 v2(27.56,20.69) ; U1.24 22.73,20.67 v1(22.73,21.77)
  PWR w0.4: v2(21.21,27.36) 20.07,26.21 20.07,24.94 19.78,24.66 17.18,24.66 v1(14.67,22.15) ; v2(21.21,27.36) 21.84,27.36 22.86,26.34 22.86,21.89 v1(22.73,21.77) 24,21.77 25.08,20.69 v2(27.56,20.69) v2(29.59,20.69) 30.73,21.83 30.73,23.16 v1(29.97,23.92) ; v2(21.21,27.36) 18.41,27.36 17.23,28.54 H2.2 ; v1(27.56,9.51) 27.56,12.37 v2(28.57,13.38) 30.23,11.73 32.38,11.73 34.71,14.06 P3.4 35.6,14.63 32.14,18.08 30.23,18.08 v1(29.59,17.45) ; v1(8,13.48) 8,11.99 H3.4 5.21,7.42 3.94,6.15 v1(3.21,6.15) 3.18,6.11 3.18,4.62 3.94,3.86 22.61,3.86 v2(24,5.26)
+5V: length 63.5
  Top Layer w0.4: v1(5.24,25.06) 4.31,25.06 3.81,24.56 3.81,22.53 4.32,22.02 5.24,22.02 ; Q4.1 4.32,4.31 4.32,7.29 4.95,7.92 7.88,7.92 v1(9.66,6.15) ; v1(15.49,25.8) 15.49,24.06 R21.1
  PWR w0.4: 9.65,6.37 9.65,11.35 10.16,11.86 11.3,11.86 11.68,12.24 11.68,15.16 12.19,15.67 v1(12.19,19.73) ; v1(15.49,25.8) 15.49,26.21 v1(13.84,27.86) 12.21,27.86 7.25,32.82 v1(7.14,32.82) 5.21,32.82 3.68,31.29 3.68,27.23 5.24,25.67 v1(5.24,25.06) 6.25,24.05 v1(7.75,24.05)
  PWR w0.5: v1(15.62,24.05) 14.99,24.05 12.19,21.26 v1(12.19,19.73)
GND: length 35.1
  Top Layer w0.254: v1(23.62,23.16) 23.56,23.23 C2.2 ; C7.1 10.79,8.63 v1(11.4,8.03) ; U1.23 23.78,20.15 v1(23.88,20.24) ; v1(12.95,17.83) 12.95,17.75 13.55,17.15 U1.44 ; R14.1 v1(19.3,28.12) ; U1.20 21.78,18.65 21.21,18.08 v1(21.21,17.58) ; v1(19.43,14.78) 19.43,14.53 19.25,14.35 U1.8 ; C12.1 29.59,19.48 v1(29.34,19.73) ; U2.9 27.06,24.69 U2.25 ; U2.1 25.55,23.68 U2.25 ; U1.47 15.39,15.65 v1(15.49,15.54) ; v1(15.88,20.62) 16.25,21 U1.35 16.25,23.04 R21.2 ; U2.25 25.56,26.2 U2.18 ; v1(5.97,26.59) 5.67,26.3 USB1.B12 ; U2.11 27.93,25.69 v1(27.56,25.32)
  Top Layer w0.4: C9.2 27.24,17.7 v1(26.67,17.7) ; v1(32.59,10.36) 32.04,10.91 C16.2 ; 27.94,6.65 27.31,7.29 LDO1.2 ; C17.1 C14.2 v1(29.59,10.91) ; U4.3 13.67,26.47 v1(12.06,26.47)
  Bottom Layer w0.254: C1.2 21.21,11.99 v1(21.97,12.75)
  vias: v1(5.24,20.8) v1(7.9,10.37) v1(8.61,16.84) v1(8.75,19.73) v1(8.75,17.96) v1(8.75,9.07) v1(9.52,23.46) v1(9.65,26.72) v1(10.63,21.64) v1(10.67,24.69) v1(10.79,17.83) v1(10.79,14.34) v1(11.18,27.48) v1(12.64,8.03) v1(12.85,16.31) v1(13.59,21.64) v1(13.79,24.05) v1(15.49,27.29) v1(17.21,6.65) v1(18.86,6.65) v1(22.99,27.29) v1(26.42,25.07) v1(26.54,4.35) v1(26.81,26.02) v1(26.81,24.07) v1(27.56,19.52) v1(28.07,6.53) v1(29.95,26.72) v1(29.99,13.04) v1(33.34,15.81) v1(33.55,3.63) v1(34.26,5.99) v1(34.8,24.94)
VBAT+: length 101.1
  PWR w0.4: v1(11.43,23.29) 10.41,23.29 6.48,19.35 6.48,13.38 v1(7.24,12.62) ; v1(21.97,24.81) 21.08,23.93 v1(18.8,23.93)
  Bottom Layer w0.4: v1(7.24,12.62) 7.24,9.58 4.95,7.29 4.95,3.83 5.68,3.1 v1(6.36,3.1) 6.99,3.1 8.91,5.03 U3.1 21.74,5.03 24,7.29 28.45,7.29 31.75,10.59 v1(31.75,12.5) 34.04,14.78 34.04,25.83 32,27.86 28.07,27.86 27.69,28.24 v1(27.69,29.13) 26.8,30.02 24.76,30.02 24.26,29.51 24.26,25.7 23.37,24.81 v1(21.97,24.81) ; v1(11.43,23.29) 11.43,25.96 9.53,27.86 v1(8.25,27.86) 8.25,28.5 8.89,29.13 v1(9.78,29.13)
ADC: length 15.4
  Top Layer w0.254: R13.1 R14.2 ; v1(18.29,17.58) 18.29,16.94 20.25,14.98 U1.10
  Bottom Layer w0.254: v1(18.29,17.58) 18.29,18.72 19.56,19.99 19.56,25.54 v1(19.3,25.8)
BAT_ADC_EN: length 15.8
  Top Layer w0.254: v1(16.38,24.81) 19.42,24.81 R15.2 21.25,22.99 U1.25
  Bottom Layer w0.254: v1(16.38,24.81) 15.37,24.81 10.03,30.16 v1(10.03,30.97)
CTL: length 12.7
  Top Layer w0.254: R9.1 23.74,12.63 20.57,15.8 20.57,21.27 20.75,21.45 U1.26
I2C1_SCL: length 16.6
  Top Layer w0.254: v1(16.38,17.07) 15.97,16.65 U1.45 ; v1(18.51,28.8) 19.52,29.8 H2.3
  Bottom Layer w0.254: v1(16.38,17.07) 17.15,17.83 17.15,27.43 v1(18.51,28.8)
I2C1_SDA: length 18.8
  Top Layer w0.254: v1(17.53,16.43) 17.24,16.15 U1.46 ; v1(21.08,28.75) 21.26,28.75 H2.4
  Bottom Layer w0.254: v1(21.08,28.75) 17.53,25.2 v1(17.53,16.43)
I2C2_SCL: length 13.1
  Top Layer w0.254: R5.1 20.96,25.71 20.96,24.69 21.59,24.05 23.88,24.05 v1(24,24.18) ; U1.21 22.56,19.15 22.47,19.24 21.96,19.24 21.21,19.99 v1(21.21,20.5) ; U2.23 24.27,24.19
  Bottom Layer w0.254: v1(21.21,20.5) 21.21,22.66 22.73,24.18 v1(24,24.18)
I2C2_SDA: length 6.5
  Top Layer w0.254: U1.22 24.43,19.65 R4.1 25.53,21.89 24.8,22.62 U2.24
KEY1: length 17.9
  Top Layer w0.254: v1(30.73,13.39) 32.76,13.39 33.27,12.88 33.27,10.33 KEY1.1 ; v1(24,17.63) 23.81,17.82 23.78,17.82 23.54,18.06 23.51,18.06 23.43,18.15 U1.19
  Bottom Layer w0.254: v1(24,17.63) 24.69,16.94 27.56,16.94 28.61,15.89 v1(29.59,15.89) 29.62,15.92 30.23,15.92 30.73,15.42 v1(30.73,13.39)
KEY2: length 21.6
  Top Layer w0.254: v1(24,16.69) 23.97,16.65 U1.16 ; KEY2.2 30.38,3.81 31.82,3.81 32,3.99 32,6.78 30.73,8.05 30.73,11.35 30.35,11.73 28.46,11.73 R10.1 26.54,13.65 v1(26.54,13.89)
  Bottom Layer w0.254: v1(26.54,13.89) 26.54,16.28 26.29,16.53 24.16,16.53 v1(24,16.69)
KEY3: length 15.9
  Top Layer w0.254: R7.1 v1(29.97,22.4) 29.5,22.4 28.65,21.55 28.65,16.87 28.47,16.69 24.89,16.69 23.88,15.67 22.77,15.67 U1.14
  Bottom Layer w0.254: v1(32.13,23.93) 32.13,23.31 31.22,22.4 v1(29.97,22.4)
NRST: length 15.3
  Top Layer w0.254: U1.7 18.75,15.24 v1(18.8,15.29) ; R1.1 v1(27.55,15.93)
  Bottom Layer w0.254: SW1.1 27.55,12.76 v1(27.55,15.93) ; v1(18.8,15.29) 19.46,15.95 v1(25.53,15.95)
OSC32_IN: length 8.5
  Top Layer w0.254: C8.2 10.84,12.98 X2.2 12.95,12.11 13.21,11.86 16.26,11.86 16.76,12.37 16.76,13.64 U1.3
OSC32_OUT: length 9.2
  Top Layer w0.254: U1.4 17.27,13.63 17.27,12.11 16.51,11.35 13.21,11.35 12.95,11.1 X2.1 11.09,10.48 C7.2
OSC_IN: length 8
  Top Layer w0.254: C6.2 15.81,9.02 X1.2 16.34,9.19 17.75,10.6 U1.5
OSC_OUT: length 8.1
  Top Layer w0.254: C5.2 20.26,9.02 X1.1 19.69,9.19 18.25,10.63 U1.6
SWCLK: length 13.2
  Top Layer w0.254: H3.1 6.1,16.81 6.73,16.18 R3.1 7.75,16.18 8,16.43 8,18.47 8.25,18.72 12.95,18.72 13.13,18.9 13.13,20.37 13.41,20.65 U1.37
SWDIO: length 16.7
  Top Layer w0.254: v1(16,18.47) 16.75,19.21 U1.34 ; H3.2 5.46,14.02 6.22,14.02 6.6,14.4 v1(7.25,14.4)
  Bottom Layer w0.254: v1(16,18.47) 14.73,17.19 10.04,17.19 v1(7.25,14.4)
USART_RX: length 20.9
  Top Layer w0.254: P3.2 34.78,18.34 v1(33.27,18.34) ; v1(19.56,18.21) 18.25,19.52 U1.31
  Bottom Layer w0.254: v1(19.56,18.21) 19.69,18.34 v1(33.27,18.34)
USART_TX: length 20.4
  Top Layer w0.254: v1(19.81,19.35) 18.75,20.42 U1.30 ; P3.1 33.37,19.48 v1(33.27,19.48)
  Bottom Layer w0.254: v1(33.27,19.48) 32.64,18.85 20.32,18.85 v1(19.81,19.35)
VOUT: length 69.6
  Top Layer w0.4: v1(26.81,8.24) 28.89,8.24 29.59,8.94 v1(29.59,9.51) ; v1(26.81,6.34) 24.46,3.99 14.86,3.99 13.74,5.1 D5.1 12.45,6.27 10.41,4.24 8.25,4.24 7.49,3.48 7.49,2.46 7.18,2.15 Q4.2
  PWR w0.4: v1(26.67,31.42) 26.92,31.67 31.88,31.67 33.53,30.02 33.53,21 32.74,20.22 30.91,20.22 25.65,14.97 25.65,9.39 v1(26.81,8.24) v1(26.81,6.34) ; v1(29.59,9.51) v1(31.75,9.51)
$1N72: length 1.9
  Top Layer w0.254: C11.1 23.41,25.89 23.61,25.69 U2.20
$1N125: length 14.1
  Top Layer w0.254: v1(12.57,14.59) 13.65,14.59 14.6,13.64 15.74,13.64 U1.1
  Bottom Layer w0.254: v1(8.8,10.84) 9.78,10.84 12.57,13.64 v1(12.57,14.59) 10.61,12.62 v1(8.8,12.62)
$1N152: length 1.1
  Top Layer w0.254: v1(29.84,25.26) 29.78,25.19 U2.10
$2N2: length 9.5
  Top Layer w0.254: R12.1 5.85,10.46 3.3,10.46 1.66,8.83 LED1.1
$2N7: length 7.1
  Top Layer w0.254: R13.2 17.53,27.86 16.89,28.5 12.95,28.5 12.45,29.01 12.45,29.9 Q3.3
$2N14: length 7.8
  Top Layer w0.254: R9.2 26.3,14.91 28.82,14.91 R8.2 30.22,14.14 30.68,14.6 30.68,15.62 30.86,15.8 31.42,15.8 Q2.1
$2N19: length 20.1
  Top Layer w0.254: R6.2 32.38,14.77 Q2.3 32.38,19.1 32.13,19.36 v1(32.13,20.88)
  Bottom Layer w0.254: v1(25.78,29.13) 25.78,23.67 27.69,21.77 31.24,21.77 v1(32.13,20.88)
$2N21: length 8.6
  Top Layer w0.254: D1.1 31.37,22.66 31.24,22.78 31.24,26.97 31.5,27.23 D2.1 33.09,27.23 KEY3.1
$2N32: length 5.7
  Top Layer w0.254: R22.1 7.25,23.03 6.23,24.05 USB1.A5
$2N33: length 6.3
  Top Layer w0.254: R23.1 6.31,18.89 6.31,22.66 5.92,23.05 USB1.B5
$2N35: length 4.8
  Top Layer w0.254: U4.2 12.95,25.32 12.7,25.07 12.7,22.16 R18.1
$2N37: length 9.5
  Top Layer w0.254: U4.7 v1(6.35,25.32) ; v1(2.29,29.77) 2.29,30.64 LED2.1
  Bottom Layer w0.254: v1(2.29,29.77) 2.87,29.19 2.87,27.03 3.05,26.85 4.83,26.85 v1(6.35,25.32)
$2N38: length 14.9
  Top Layer w0.254: LED2.2 3.8,25.84 v1(3.81,25.83)
  Bottom Layer w0.254: v1(10.63,19.73) 5.94,24.43 4.06,24.43 3.81,24.69 v1(3.81,25.83)
$2N40: length 1.8
  Top Layer w0.254: LED3.2 5.59,32.82 R20.1
$2N41: length 12.8
  Top Layer w0.254: LED3.1 2.25,32.35 2.79,31.8 7.75,31.8 8.89,30.66 8.89,26.85 8.64,26.59 U4.6

## Copper pours and planes (outline as drawn; the poured copper is in the pictures)
GND on GND: 0.26,35.54 36.74,35.54 36.74,0.26 0.26,0.26

Small or netless copper shapes (teardrops, artwork), in the pictures only: 214 on Top Layer, 57 on Bottom Layer, 25 on GND, 45 on PWR

## Text on the board
Bottom Silkscreen Layer: 这是一个LOGO
Top Silkscreen Layer: CLK | DIO | GND | 3V3
